# EasyEDA Pro project ProPrj_ST-Link_2025-02-09.epro, schematic ST-LINK_v1
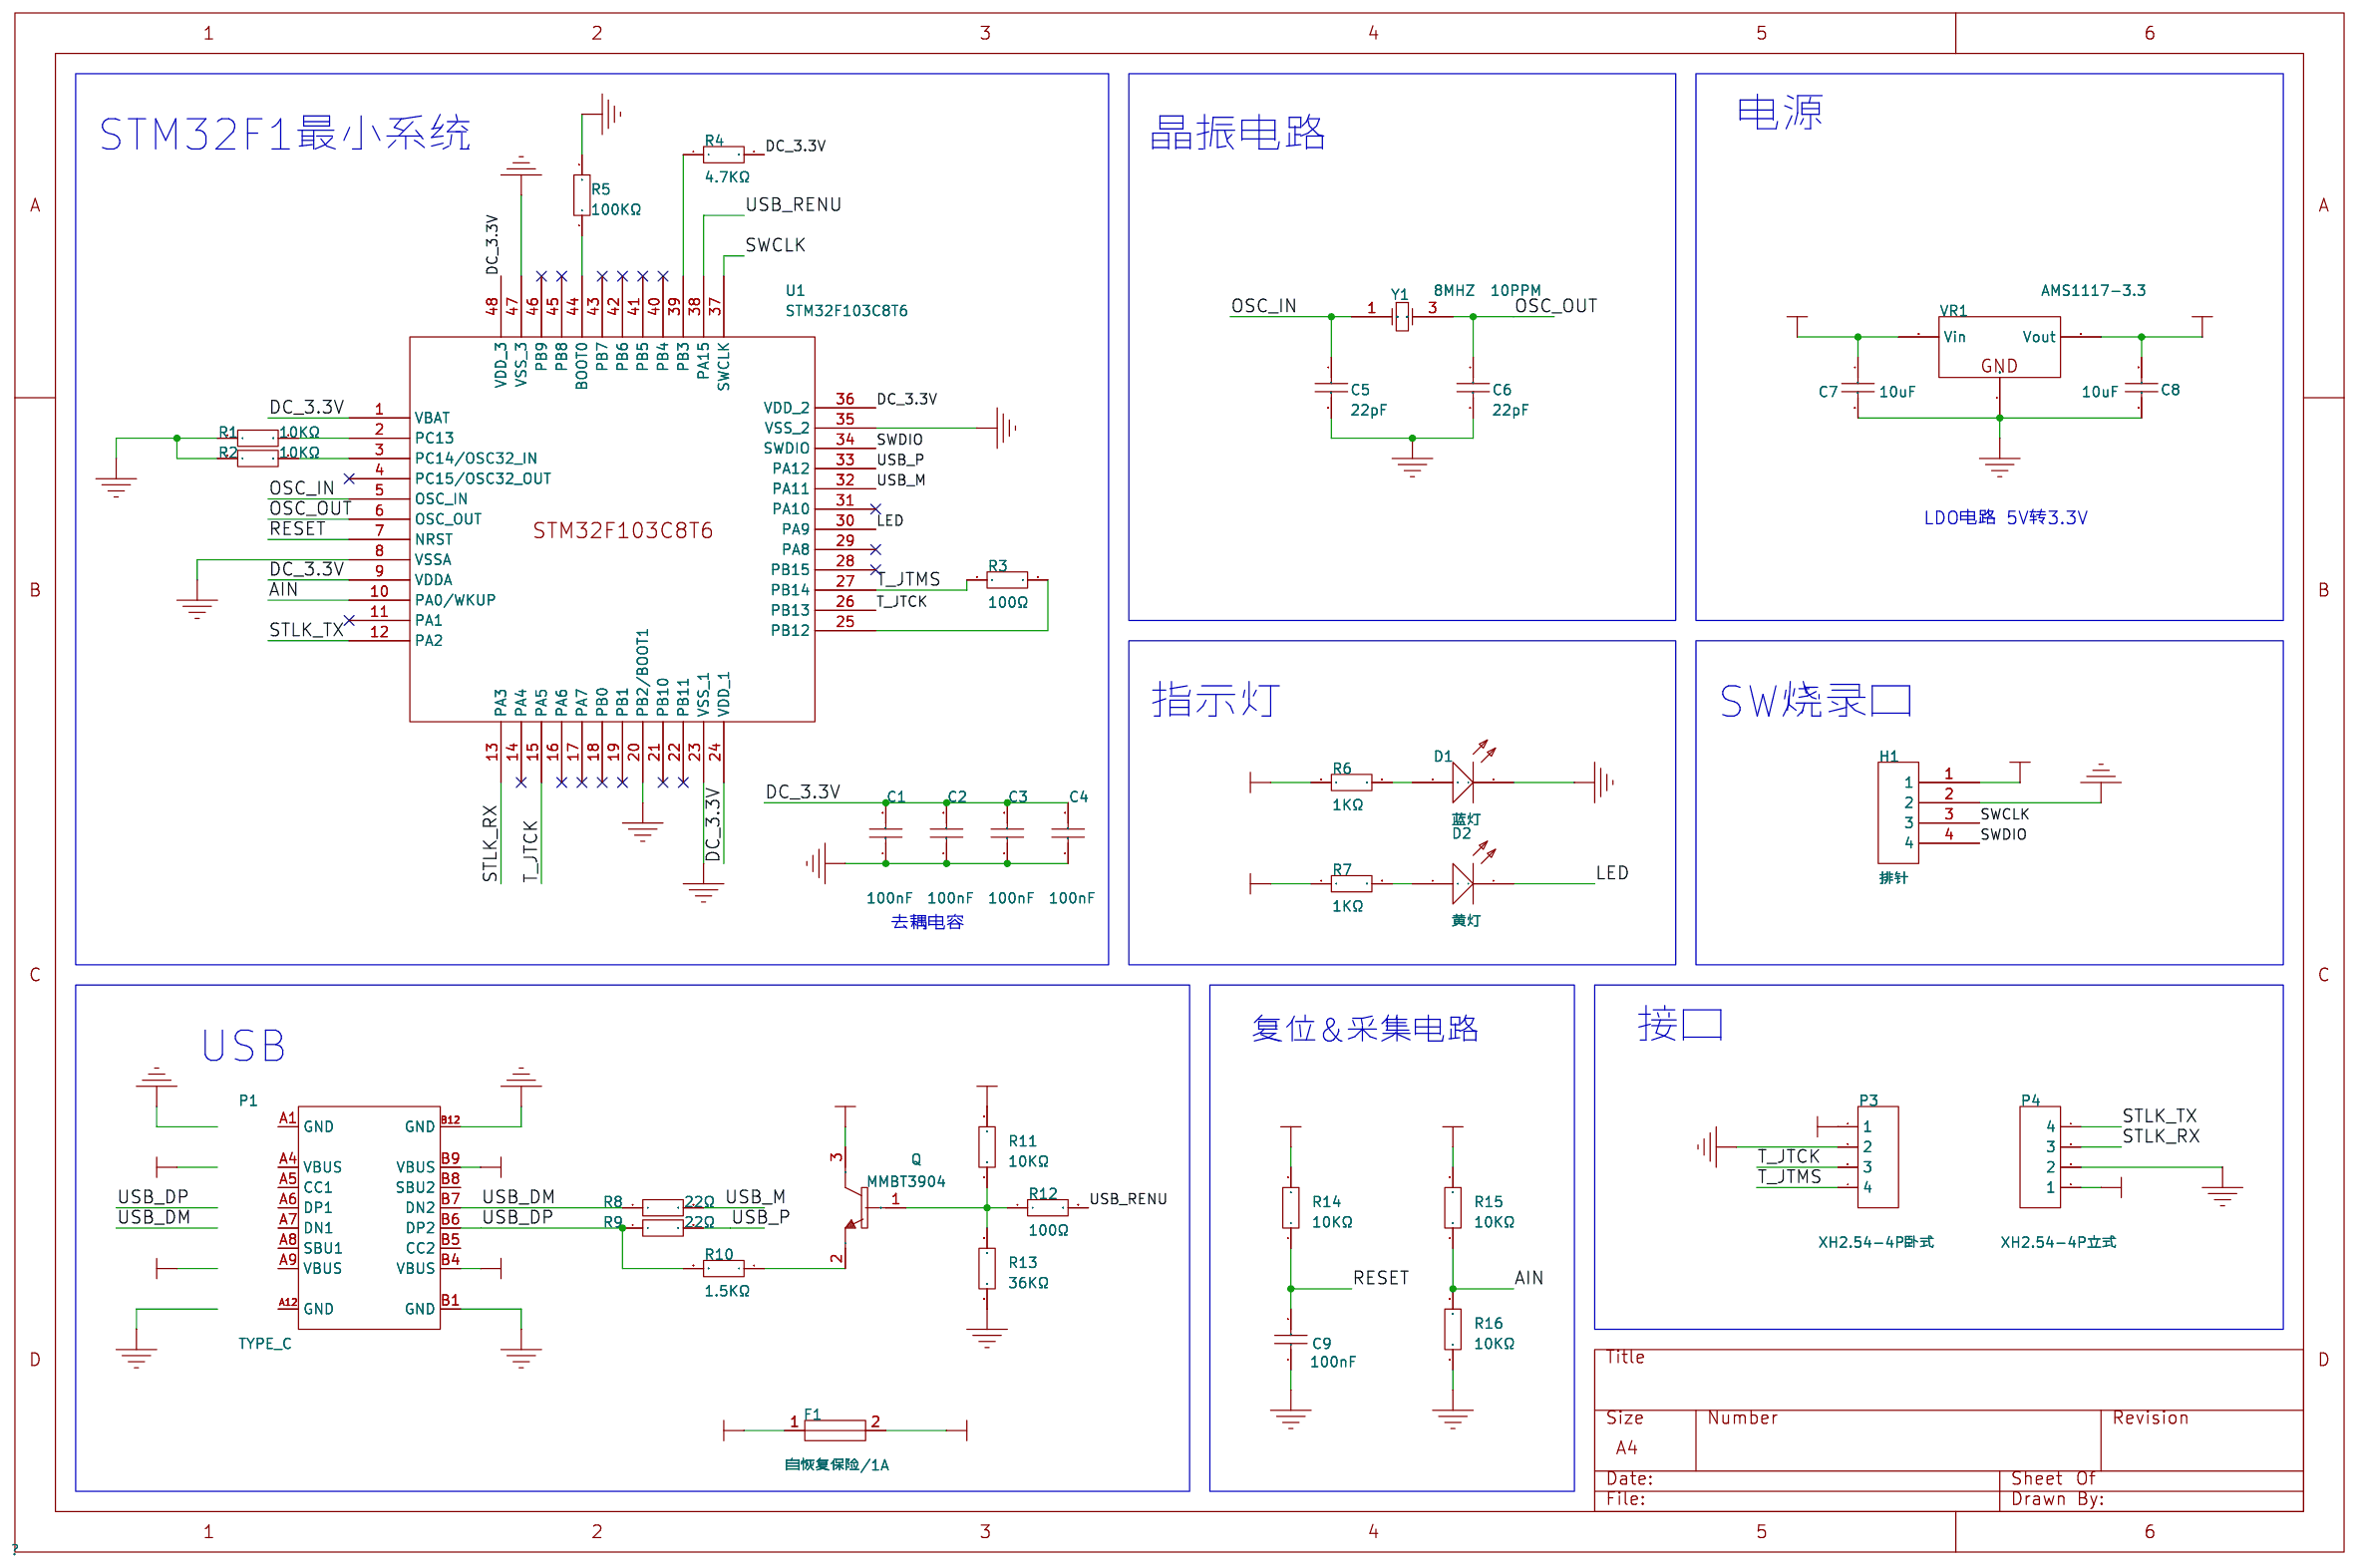
[diagram p0: schematic sheet]

## Parts
C1  100nF  [0603_C]
C2  100nF  [0603_C]
C3  100nF  [0603_C]
C4  100nF  [0603_C]
C5  22pF  [0603_C]
C6  22pF  [0603_C]
C7  10uF  [0603_C]
C8  10uF  [0603_C]
C9  100nF  [0603_C]
D1  蓝灯  [0603_LED_S1]
D2  黄灯  [0603_LED_S1]
F1  自恢复保险/1A  [0805_R]
H1  排针  [HDR2.54-LI-4P]
P1  TYPE_C  [Type-C_16P]
P3  XH2.54-4P卧式  [XH2.54_4P卧式]
P4  XH2.54-4P立式  [XH2.54_4P立式]
Q  *  [SOT95P240X120-3N]
R1  10KΩ  [0603_R]
R2  10KΩ  [0603_R]
R3  100Ω  [0603_R]
R4  4.7KΩ  [0603_R]
R5  100KΩ  [0603_R]
R6  1KΩ  [0603_R]
R7  1KΩ  [0603_R]
R8  22Ω  [0603_R]
R9  22Ω  [0603_R]
R10  1.5KΩ  [0603_R]
R11  10KΩ  [0603_R]
R12  100Ω  [0603_R]
R13  36KΩ  [0603_R]
R14  10KΩ  [0603_R]
R15  10KΩ  [0603_R]
R16  10KΩ  [0603_R]
U1  STM32F103C8T6  [STM32F103C8T6]
VR1  AMS1117-3.3  [SOT-223]
Y1  8MHZ  10PPM  [SMD-3225_4P]

## Library data of the parts
C1-C4 C9 = 100nF: 贴片电容; ComponentLink1Description: 供应商链接; ComponentLink1URL: http://www.szlcsc.com/product/details_15331.html; Package1: 0603; Supplier: LC; SuppliersPartNumber: C14663; Design Item ID: 0603 100nF (104) 10% 50V; Library Name: Miscellaneous Devices LC
C5 C6 = 22pF: 贴片电容; ComponentLink1Description: 供应商链接; ComponentLink1URL: http://www.szlcsc.com/product/details_2005.html; Package1: 0603; Supplier: LC; SuppliersPartNumber: C1653; Design Item ID: 0603 22pF (220) 5% 50V; Library Name: Miscellaneous Devices LC
C7 C8 = 10uF: 贴片电容; ComponentLink1Description: 供应商链接; ComponentLink1URL: http://www.szlcsc.com/product/details_20411.html; Package1: 0603; Supplier: LC; SuppliersPartNumber: C19702; Design Item ID: 0603 10uF (106) 10% 10V; Library Name: Miscellaneous Devices LC
D1 = 蓝灯 : 发光二极管; ComponentLink1Description: 供应商链接; ComponentLink1URL: http://www.szlcsc.com/product/details_73150.html; Package1: 0603; Supplier: LC; SuppliersPartNumber: C72041; Design Item ID: 0603 蓝灯; Library Name: Miscellaneous Devices LC
D2 = 黄灯: 发光二极管; ComponentLink1Description: 供应商链接; ComponentLink1URL: http://www.szlcsc.com/product/details_73147.html; Package1: 0603; Supplier: LC; SuppliersPartNumber: C72038; Design Item ID: 0603 黄灯; Library Name: Miscellaneous Devices LC
F1 = 自恢复保险/1A: 保险丝; Design Item ID: 保险丝0805（自恢复）; Library Name: Other_Library
H1 = 排针: Design Item ID: 排针HDR2.54-LI-4P; Library Name: Switch - button - interface
P1 = TYPE_C: USB接口; Design Item ID: Tpye C 16线母座; Library Name: Switch - button - interface
P3 = XH2.54-4P卧式: XH2.54-2P接口; Library Name: Switch - button - interface
P4 = XH2.54-4P立式: XH2.54-2P接口; Library Name: Switch - button - interface
Q = MMBT3904: 三极管NPN(BJT); Price: None; Package1: SOT-23-3 Taiwan Semiconductor; Availability: Unavailable; SnapEDA_Link: https://www.snapeda.com/parts/MMBT3904/STMicroelectronics/view-part/2875870/?ref=snap; MF: STMicroelectronics; Library Name: Other_Library
R1 R2 R11 R14-R16 = 10KΩ: 贴片电阻; ComponentLink1Description: 供应商链接; ComponentLink1URL: http://www.szlcsc.com/product/details_26547.html; Package1: 0603; Supplier: LC; SuppliersPartNumber: C25804; Design Item ID: 0603 10KΩ (1002) 1%; Library Name: Miscellaneous Devices LC
R3 R12 = 100Ω : 贴片电阻; ComponentLink1Description: 供应商链接; ComponentLink1URL: http://www.szlcsc.com/product/details_23502.html; Package1: 0603; Supplier: LC; SuppliersPartNumber: C22775; Design Item ID: 0603 100Ω (1000) 1%; Library Name: Miscellaneous Devices LC
R4 = 4.7KΩ : 贴片电阻; ComponentLink1Description: 供应商链接; ComponentLink1URL: http://www.szlcsc.com/product/details_23889.html; Package1: 0603; Supplier: LC; SuppliersPartNumber: C23162; Design Item ID: 0603 4.7KΩ (4701) 1%; Library Name: Miscellaneous Devices LC
R5 = 100KΩ: 贴片电阻; ComponentLink1Description: 供应商链接; ComponentLink1URL: http://www.szlcsc.com/product/details_26546.html; Package1: 0603; Supplier: LC; SuppliersPartNumber: C25803; Design Item ID: 0603 100KΩ (1003) 1%; Library Name: Miscellaneous Devices LC
R6 R7 = 1KΩ: 贴片电阻; ComponentLink1Description: 供应商链接; ComponentLink1URL: http://www.szlcsc.com/product/details_21904.html; Package1: 0603; Supplier: LC; SuppliersPartNumber: C21190; Design Item ID: 0603 1KΩ (1001) 1%; Library Name: Miscellaneous Devices LC
R8 R9 = 22Ω: 贴片电阻; ComponentLink1Description: 供应商链接; ComponentLink1URL: http://www.szlcsc.com/product/details_24078.html; Package1: 0603; Supplier: LC; SuppliersPartNumber: C23345; Design Item ID: 0603 22Ω (22R0) 1%; Library Name: Miscellaneous Devices LC
R10 = 1.5KΩ: 贴片电阻; ComponentLink1Description: 供应商链接; ComponentLink1URL: http://www.szlcsc.com/product/details_23570.html; Package1: 0603; Supplier: LC; SuppliersPartNumber: C22843; Design Item ID: 0603 1.5KΩ (1501) 1%; Library Name: Miscellaneous Devices LC
R13 = 36KΩ: 贴片电阻; ComponentLink1Description: 供应商链接; ComponentLink1URL: http://www.szlcsc.com/product/details_23874.html; Package1: 0603; Supplier: LC; SuppliersPartNumber: C23147; Design Item ID: 0603 36KΩ (3602) 1%; Library Name: Miscellaneous Devices LC
U1 = STM32F103C8T6: STM32芯片; Library Name: MCU
VR1 = AMS1117-3.3: 低压差线性稳压(LDO); ComponentLink1Description: 供应商链接; ComponentLink1URL: http://www.szlcsc.com/product/details_6652.html; Supplier: LC; SuppliersPartNumber: C6186; Design Item ID: SOT-223 AMS1117-3.3; Library Name: Miscellaneous Devices LC
Y1 = 8MHZ  10PPM: 贴片晶振; ComponentLink1Description: 供应商链接; ComponentLink1URL: http://www.szlcsc.com/product/details_14393.html; Supplier: LC; SuppliersPartNumber: C13738; Design Item ID: SMD-3225_4P  16MHZ 9PF 10PPM; Library Name: Miscellaneous Devices LC

## Nets
GND: C1.1 C2.1 C3.1 C4.1 C5.2 C6.2 C7.2 C8.1 C9.1 D1.K H1.2 P1.B1(GND) P1.B12(GND) P3.2 P4.2 R1.1 R2.1 R5.2 R13.1 R16.1 U1.8(VSSA) U1.20(PB2/BOOT1) U1.23(VSS_1) U1.35(VSS_2) U1.47(VSS_3) VR1.1(GND)
VBUS: F1.1 P1.B4(VBUS) P1.B9(VBUS)
AIN: R15.1 R16.2 U1.10(PA0/WKUP)
DC_3.3V: C1.2 C2.2 C3.2 C4.2 C8.2 H1.1 P3.1 Q.3(C) R4.2 R6.1 R7.1 R14.2 R15.2 U1.1(VBAT) U1.9(VDDA) U1.24(VDD_1) U1.36(VDD_2) U1.48(VDD_3) VR1.2(Vout)
DC_5V: C7.1 F1.2 P4.1 R11.2 VR1.3(Vin)
LED: D2.K U1.30(PA9)
OSC_IN: C5.1 U1.5(OSC_IN) Y1.1(OSC1)
OSC_OUT: C6.1 U1.6(OSC_OUT) Y1.3(OSC2)
RESET: C9.2 R14.1 U1.7(NRST)
STLK_RX: P4.3 U1.13(PA3)
STLK_TX: P4.4 U1.12(PA2)
SWCLK: H1.3 U1.37(SWCLK)
SWDIO: H1.4 U1.34(SWDIO)
T_JTCK: P3.3 U1.15(PA5) U1.26(PB13)
T_JTMS: P3.4 R3.1 U1.27(PB14)
USB_DM: P1.B7(DN2) R8.1
USB_DP: P1.B6(DP2) R9.1 R10.2
USB_M: R8.2 U1.32(PA11)
USB_P: R9.2 U1.33(PA12)
USB_RENU: R12.2 U1.38(PA15)
NETD1_A: D1.A R6.2
NETD2_A: D2.A R7.2
NETQ_1: Q.1(B) R11.1 R12.1 R13.2
NETQ_2: Q.2(E) R10.1
NETR1_2: R1.2 U1.2(PC13)
NETR2_2: R2.2 U1.3(PC14/OSC32_IN)
NETR3_2: R3.2 U1.25(PB12)
NETR4_1: R4.1 U1.39(PB3)
NETR5_1: R5.1 U1.44(BOOT0)

Not connected (* = marked no-connect by the designer): P1 A1(GND) A4(VBUS) A5(CC1) A6(DP1) A7(DN1) A8(SBU1) A9(VBUS) A12(GND) B5(CC2) B8(SBU2); U1 4(PC15/OSC32_OUT)* 11(PA1)* 14(PA4)* 16(PA6)* 17(PA7)* 18(PB0)* 19(PB1)* 21(PB10)* 22(PB11)* 28(PB15)* 29(PA8)* 31(PA10)* 40(PB4)* 41(PB5)* 42(PB6)* 43(PB7)* 45(PB8)* 46(PB9)*

## Notes on the sheet
- 电源
- STM32F1最小系统
- 晶振电路
- LDO电路 5V转3.3V
- 指示灯
- SW烧录口
- 去耦电容
- 复位&采集电路
- 接口
- USB
